# Altium schematic sheet pca10040_sheet1_radio.SchDoc: PCA10040 - nRF Radio
size A4; Revision: 1.1.1; SheetNumber: 1; SheetTotal: 5; DrawnBy: KJP; ProjectNumber: 4397; PCBRevision: 0071KJP; DocumentSize: A4; PCAName: PCA10040; PCBNumber: 400150; ProjectName: Quark
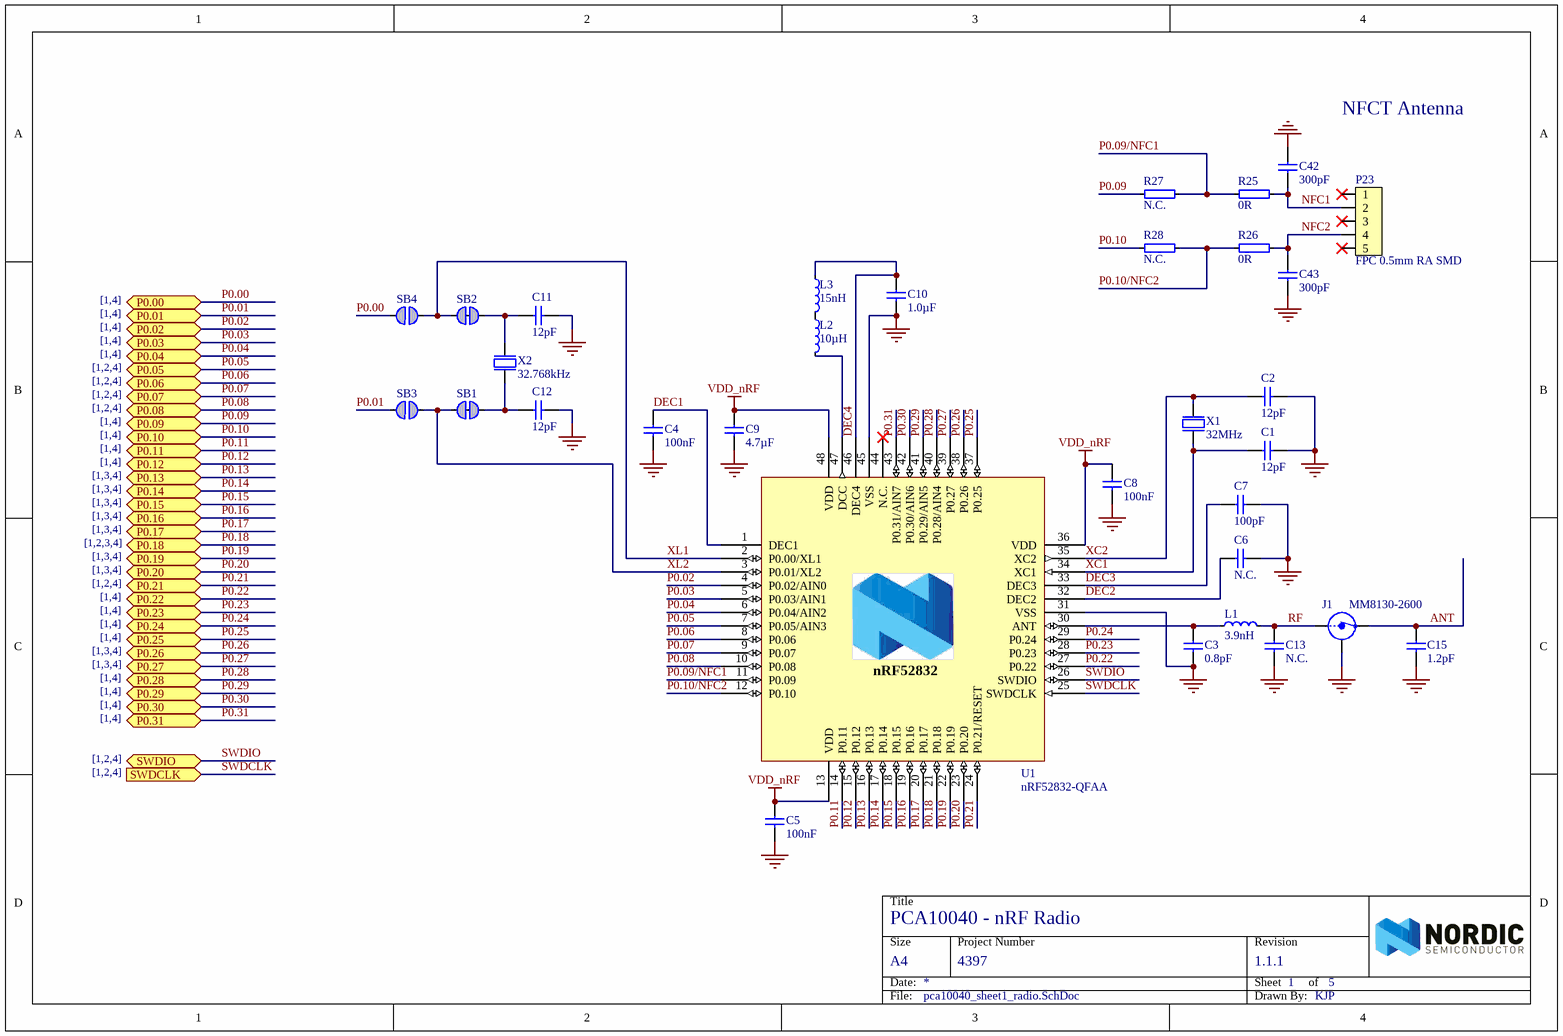
[diagram p0: pca10040_sheet1_radio.SchDoc]

## Parts
C1  12pF  [CAPC1005X04L]
C2  12pF  [CAPC1005X04L]
C3  0.8pF  [CAPC1005X04L]
C4  100nF  [CAPC1005X04L]
C5  100nF  [CAPC1005X04L]
C6  N.C.  [CAPC1005X04L]
C7  100pF  [CAPC1005X04L]
C8  100nF  [CAPC1005X04L]
C9  4.7µF  [CAPC1608X06L]
C10  1.0µF  [CAPC1608X06L]
C11  12pF  [CAPC1005X04L]
C12  12pF  [CAPC1005X04L]
C13  N.C.  [CAPC1005X04L]
C15  1.2pF  [CAPC1005X04L]
C42  300pF  [CAPC1005X04L]
C43  300pF  [CAPC1005X04L]
J1  MM8130-2600  [COAXIAL-SWF]
L1  3.9nH  [INDC1005X04L]
L2  10µH  [INDC1608X06L]
L3  15nH  [INDC1005X04L]
P23  FPC 0.5mm RA SMD  [FPC_05P-0.5mm-RA-SMD]
R25  0R  [RESC1005X04L]
R26  0R  [RESC1005X04L]
R27  N.C.  [RESC1005X04L]
R28  N.C.  [RESC1005X04L]
SB1  Solderbridge  [Solderbridge_Shorted]  (value not drawn)  (net tie, no BOM)
SB2  Solderbridge  [Solderbridge_Shorted]  (value not drawn)  (net tie, no BOM)
SB3  Solderbridge  [Solderbridge]  (value not drawn)  (no BOM)
SB4  Solderbridge  [Solderbridge]  (value not drawn)  (no BOM)
U1  nRF52832-QFAA  [QFN40P600X600X90-48N]
X1  32MHz  [BT-XTAL_2016]
X2  32.768kHz  [XTAL_3215]

## Ports
P0.00 (bidir), P0.01 (bidir), P0.02 (bidir), P0.03 (bidir), P0.04 (bidir), P0.05 (bidir), P0.06 (bidir), P0.07 (bidir), P0.08 (bidir), P0.09 (bidir), P0.10 (bidir), P0.11 (bidir), P0.12 (bidir), P0.13 (bidir), P0.14 (bidir), P0.15 (bidir), P0.16 (bidir), P0.17 (bidir), P0.18 (bidir), P0.19 (bidir), P0.20 (bidir), P0.21 (bidir), P0.22 (bidir), P0.23 (bidir), P0.24 (bidir), P0.25 (bidir), P0.26 (bidir), P0.27 (bidir), P0.28 (bidir), P0.29 (bidir), P0.30 (bidir), P0.31 (bidir), SWDCLK (in), SWDIO (bidir)

## Nets
GND: C1.2 C2.2 C3.1 C4.2 C5.2 C6.2 C7.2 C8.2 C9.2 C10.1 C11.1 C12.1 C13.2 C15.2 C42.2 C43.1 J1.2(Shield) U1.31(VSS) U1.45(VSS) U1.49(GND) X1.2(GND) X1.4(GND)
VDD_nRF: C5.1 C8.1 C9.1 U1.13(VDD) U1.36(VDD) U1.48(VDD)
ANT: C15.1 J1.3(OUT)
DEC1: C4.1 U1.1(DEC1)
DEC2: C6.1 U1.32(DEC2)
DEC3: C7.1 U1.33(DEC3)
DEC4: C10.2 L3.1 U1.46(DEC4)
NFC1: C42.1 P23.2 R25.1
NFC2: C43.2 P23.4 R26.1
P0.00: SB4.2 ; port P0.00
P0.01: SB3.2 ; port P0.01
P0.02: U1.4(P0.02/AIN0) ; port P0.02
P0.03: U1.5(P0.03/AIN1) ; port P0.03
P0.04: U1.6(P0.04/AIN2) ; port P0.04
P0.05: U1.7(P0.05/AIN3) ; port P0.05
P0.06: U1.8(P0.06) ; port P0.06
P0.07: U1.9(P0.07) ; port P0.07
P0.08: U1.10(P0.08) ; port P0.08
P0.09: R27.1 ; port P0.09
P0.09/NFC1: R25.2 R27.2 U1.11(P0.09)
P0.10: R28.1 ; port P0.10
P0.10/NFC2: R26.2 R28.2 U1.12(P0.10)
P0.11: U1.14(P0.11) ; port P0.11
P0.12: U1.15(P0.12) ; port P0.12
P0.13: U1.16(P0.13) ; port P0.13
P0.14: U1.17(P0.14) ; port P0.14
P0.15: U1.18(P0.15) ; port P0.15
P0.16: U1.19(P0.16) ; port P0.16
P0.17: U1.20(P0.17) ; port P0.17
P0.18: U1.21(P0.18) ; port P0.18
P0.19: U1.22(P0.19) ; port P0.19
P0.20: U1.23(P0.20) ; port P0.20
P0.21: U1.24(P0.21/RESET) ; port P0.21
P0.22: U1.27(P0.22) ; port P0.22
P0.23: U1.28(P0.23) ; port P0.23
P0.24: U1.29(P0.24) ; port P0.24
P0.25: U1.37(P0.25) ; port P0.25
P0.26: U1.38(P0.26) ; port P0.26
P0.27: U1.39(P0.27) ; port P0.27
P0.28: U1.40(P0.28/AIN4) ; port P0.28
P0.29: U1.41(P0.29/AIN5) ; port P0.29
P0.30: U1.42(P0.30/AIN6) ; port P0.30
P0.31: U1.43(P0.31/AIN7) ; port P0.31
RF: C13.1 J1.1(IN) L1.2
SWDCLK: U1.25(SWDCLK) ; port SWDCLK
SWDIO: U1.26(SWDIO) ; port SWDIO
XC1: C1.1 U1.34(XC1) X1.1(inp)
XC2: C2.1 U1.35(XC2) X1.3(out)
XL1: SB2.2 SB4.1 U1.2(P0.00/XL1)
XL2: SB1.2 SB3.1 U1.3(P0.01/XL2)
NetC3_2: C3.2 L1.1 U1.30(ANT)
NetC11_2: C11.2 SB2.1 X2.1(inp)
NetC12_2: C12.2 SB1.1 X2.2(out)
NetL2_1: L2.1 L3.2
NetL2_2: L2.2 U1.47(DCC)

Not connected (* = marked no-connect by the designer): P23 1* 3* 5*; U1 44(N.C.)*

## Notes on the sheet
- NFCT Antenna
- [1,4]
- [1,2,4]
- [1,3,4]
- [1,2,3,4]
- Title
- Size
- Date:
- Project Number
- Sheet         of
- Revision
- File:
- Drawn By:
- (in symbol nRF52832-QFAA) nRF52832

## Library data of the parts
C1 C2 C11 C12 = C0402-12p: Capacitor, NP0, ±2%; Note: 50V; Artikkelnr Noca: 20029159; Artikkelnr Simpro: N.A.; Part Number: C0402-12p; Manufacturer: *; Manufacturer Part Number: *; Datasheet: *; LatestRevisionDate: 2011-05-11; Pin Count: 2; Publisher: Nordic Semiconductor; Published: 2009-05-08; Value: 12pF; Supplier: *; Supplier part number: *; 2nd source Supplier: *; 2nd source part number: *; Footprint Doc: 0402
C3 = C0402-0.8p: Capacitor, NP0, ±5%; Note: 50V; Artikkelnr Noca: 20029147; Artikkelnr Simpro: N.A.; Part Number: C0402-0.8p; Manufacturer: *; Manufacturer Part Number: *; Datasheet: *; LatestRevisionDate: 2012-11-21; Pin Count: 2; Publisher: Nordic Semiconductor; Published: 2009-05-08; Value: 0.8pF; Supplier: *; Supplier part number: *; 2nd source Supplier: *; 2nd source part number: *; Footprint Doc: 0402
C4 C5 C8 = C0402-100n: Capacitor, X7R, ±10%; Note: 16V; Artikkelnr Noca: 20039200; Artikkelnr Simpro: N.A.; Part Number: C0402-100n; Manufacturer: *; Manufacturer Part Number: *; Datasheet: *; LatestRevisionDate: 2009-11-23; Pin Count: 2; Publisher: Nordic Semiconductor; Published: 2009-05-08; Value: 100nF; Supplier: *; Supplier part number: *; 2nd source Supplier: *; 2nd source part number: *; Footprint Doc: 0402
C6 C13 = C0402-N.C.: Not mounted; Note: Chip Cap; Artikkelnr Noca: N.A.; Part Number: C0402-N.C.; Manufacturer: *; Manufacturer Part Number: *; Datasheet: *; Footprint Doc: 0402; LatestRevisionDate: 2009-05-08; Pin Count: 2; Publisher: Nordic Semiconductor; Published: 2009-05-08; Value: N.C.; Supplier: *; Supplier part number: *; 2nd source Supplier: *; 2nd source part number: *; Artikkelnr Simpro: N.A.
C7 = C0402-100p: Capacitor, NP0, ±5%; Note: 50V; Artikkelnr Noca: 20029135; Artikkelnr Simpro: N.A.; Part Number: C0402-100p; Manufacturer: *; Manufacturer Part Number: *; Datasheet: *; LatestRevisionDate: 2009-05-08; Pin Count: 2; Publisher: Nordic Semiconductor; Published: 2009-05-08; Value: 100pF; Supplier: *; Supplier part number: *; 2nd source Supplier: *; 2nd source part number: *; Footprint Doc: 0402
C9 = C0603-4µ7: Capacitor, X5R, ±10%; Note: 6.3V; Artikkelnr Noca: 20069060; Artikkelnr Simpro: N.A.; Part Number: C0603-4µ7; Manufacturer: *; Manufacturer Part Number: *; Datasheet: *; LatestRevisionDate: 2009-11-23; Pin Count: 2; Publisher: Nordic Semiconductor; Published: 2009-05-08; Value: 4.7µF; Supplier: *; Supplier part number: *; 2nd source Supplier: *; 2nd source part number: *; Footprint Doc: 0603
C10 = C0603-1µ0: Capacitor, X7R, ±10%; Note: 16V; Artikkelnr Noca: 20039335; Artikkelnr Simpro: N.A.; Part Number: C0603-1µ0; Manufacturer: *; Manufacturer Part Number: *; Datasheet: *; LatestRevisionDate: 2013-06-05; Pin Count: 2; Publisher: Nordic Semiconductor; Published: 2009-05-08; Value: 1.0µF; Supplier: *; Supplier part number: *; 2nd source Supplier: *; 2nd source part number: *; Footprint Doc: 0603
C15 = C0402-1.2p: Capacitor, NP0, ±0.1pF; Note: 50V; Artikkelnr Noca: 20029157; Artikkelnr Simpro: N.A.; Part Number: C0402-1.2p; Manufacturer: *; Manufacturer Part Number: *; Datasheet: *; LatestRevisionDate: 2011-05-11; Pin Count: 2; Publisher: Nordic Semiconductor; Published: 2009-05-08; Value: 1.2pF; Supplier: *; Supplier part number: *; 2nd source Supplier: *; 2nd source part number: *; Footprint Doc: 0402
C42 C43 = C0402-300p: Capacitor, NP0, ±5%; Note: 50V; Artikkelnr Noca: N.A.; Part Number: C0402-300p; Manufacturer: *; Manufacturer Part Number: *; Datasheet: *; Footprint Doc: 0402; LatestRevisionDate: 2015-05-29; Pin Count: 2; Publisher: Nordic Semiconductor; Published: 2015-05-29; Value: 300pF; Supplier: Digi-Key; Supplier part number: 490-3234-1-ND; 2nd source Supplier: *; 2nd source part number: *; Artikkelnr Simpro: N.A.
J1 = MM8130-2600: Coaxial Connector with Switch; Manufacturer: Murata; 2nd source part number: 81-MM8130-2600RA2; Artikkelnr Noca: 55029011; Artikkelnr Simpro: N.A.; Part Number: MM8130-2600; Manufacturer Part Number: MM8130-2600; Datasheet: http://www.murata.com/products/catalog/pdf/o33e.pdf; LatestRevisionDate: 2014-04-24; Pin Count: 3; Publisher: Nordic Semiconductor; Published: 2014-04-24; Value: MM8130-2600; Note: *; Supplier: Digi-Key; Supplier part number: 490-4981-1-ND; 2nd source Supplier: Mouser; Footprint Doc: COAXIAL-SWF
L1 = L0402-3n9: Inductor, 170mA, ±0.1nH; Manufacturer: Murata; Manufacturer Part Number: LQP15MN3N9B02D; Note: High frequency chip inductor ±5%; Artikkelnr Noca: 33029151; Artikkelnr Simpro: N.A.; Part Number: L0402-3n9; Datasheet: http://search.murata.co.jp/Ceramy/image/img/PDF/ENG/L0075S0084LQP15M.pdf; LatestRevisionDate: 2012-09-19; Pin Count: 2; Publisher: Nordic Semiconductor; Published: 2009-05-08; Value: 3.9nH; Supplier: Digi-Key; Supplier part number: 490-1131-1-ND; 2nd source Supplier: *; 2nd source part number: *; Footprint Doc: 0402
L2 = L0603-10µ: Inductor, 80mA, ±10%; Manufacturer: Taiyo Yuden; Manufacturer Part Number: LBMF1608T100K; 2nd source part number: 178-6105; Note: LBMF1608T100K 10µH 80mA 0603; Artikkelnr Noca: 33029314; Artikkelnr Simpro: N.A.; Part Number: L0603-10µ; Datasheet: http://www.yuden.co.jp/ut/product/pdf/elb2_e.pdf; LatestRevisionDate: 2012-09-19; Pin Count: 2; Publisher: Nordic Semiconductor; Published: 2010-02-24; Value: 10µH; Supplier: Digi-Key; Supplier part number: 587-1714-1-ND; 2nd source Supplier: Farnell; Footprint Doc: 0603
L3 = L0402-15n: Inductor, 320mA, ±5%; Manufacturer: Taiyo Yuden; Manufacturer Part Number: HK100515NJ-T; 2nd source part number: 658-1328; Note: High frequency chip inductor ±10%; Artikkelnr Noca: 33029323; Artikkelnr Simpro: N.A.; Part Number: L0402-15n; LatestRevisionDate: 2012-09-19; Pin Count: 2; Publisher: Nordic Semiconductor; Published: 2010-07-12; Value: 15nH; Supplier: Digi-Key; Datasheet: http://www.yuden.co.jp/productdata/catalog/en/mlci04_e.pdf; Supplier part number: 587-1521-1-ND; 2nd source Supplier: Farnell; Footprint Doc: 0402
P23 = FPC_05P-0.5mm-RA-SMD: 0.5mm FPC, 5P,Right Angle SMT,Double Contact,H=1.2mm,White, Tin plated; Manufacturer: W-CON; Manufacturer Part Number: 5141-05RZDNWR01; 2nd source part number: WM9836CT-ND; Artikkelnr Noca: 55010020; Artikkelnr Simpro: N.A.; Part Number: FPC_05P-0.5mm-RA-SMD; Datasheet: \\hizz\pro\app9717\Datasheet\connectores\W-CON\5141-XXRZDNXX0X.pdf; Footprint Doc: FPC_05P-0.5mm-RA-SMD; LatestRevisionDate: 2016-04-21; Pin Count: 7; Publisher: Nordic Semiconductor; Published: 2015-06-22; Value: FPC 0.5mm RA SMD; Note: *; Supplier: Cabcon; Supplier part number: 5141-05RZDNWR01; 2nd source Supplier: Digi-Key
R25 R26 = R0402-0R: Resistor, ±5%, 0.063W; Note: Chip Res 5%; Artikkelnr Noca: 27049000; Artikkelnr Simpro: N.A.; Part Number: R0402-0R; Manufacturer: *; Manufacturer Part Number: *; Datasheet: *; Footprint Doc: 0402; LatestRevisionDate: 2009-11-23; Pin Count: 2; Publisher: Nordic Semiconductor; Published: 2009-05-08; Value: 0R; Supplier: Farnell; Supplier part number: 146-9661; 2nd source Supplier: *; 2nd source part number: *
R27 R28 = R0402-N.C.: Not mounted; Note: Chip Res; Artikkelnr Noca: N.A.; Part Number: R0402-N.C.; Manufacturer: *; Manufacturer Part Number: *; Datasheet: *; Footprint Doc: 0402; LatestRevisionDate: 2009-05-08; Pin Count: 2; Publisher: Nordic Semiconductor; Published: 2009-05-08; Value: N.C.; Supplier: *; Supplier part number: *; 2nd source Supplier: *; 2nd source part number: *; Artikkelnr Simpro: N.A.
SB1 SB2 = Solderbridge Shorted: Shorted Solderbridge; Artikkelnr Noca: N.A.; Part Number: Solderbridge Shorted; Manufacturer: *; Manufacturer Part Number: *; Datasheet: *; LatestRevisionDate: 2012-08-07; Pin Count: 2; Publisher: Nordic Semiconductor; Published: 2012-08-07; Value: Solderbridge; Note: *; Supplier: *; Supplier part number: *; 2nd source Supplier: *; 2nd source part number: *; Footprint Doc: Solderbridge_Shorted; Artikkelnr Simpro: N.A.
SB3 SB4 = Solderbridge: Artikkelnr Noca: N.A.; Part Number: Solderbridge; Manufacturer: *; Manufacturer Part Number: *; Datasheet: *; LatestRevisionDate: 2009-12-14; Pin Count: 2; Publisher: Nordic Semiconductor; Published: 2009-12-14; Value: Solderbridge; Note: *; Supplier: *; Supplier part number: *; 2nd source Supplier: *; 2nd source part number: *; Footprint Doc: Solderbridge; Artikkelnr Simpro: N.A.
U1 = nRF52832-QFAA: Multi-protocol Bluetooth Low Energy and 2.4GHz proprietary system-on-chip; Manufacturer: Nordic Semiconductor; Artikkelnr Noca: N.A.; Part Number: nRF52832-QFAA; Manufacturer Part Number: nRF52832-QFAA; Datasheet: *; LatestRevisionDate: 2014-11-26; Pin Count: 48; Publisher: Nordic Semiconductor; Published: 2014-11-26; Value: nRF52832-QFAA; Note: *; Supplier: Nordic Semiconductor; Supplier part number: *; 2nd source Supplier: *; 2nd source part number: *; Footprint Doc: QFN-48; Artikkelnr Simpro: N.A.
X1 = XTAL_SMD2016_32MHz_8pF_Epson: XTAL SMD 2016, 32MHz, Cl=8pF, Tol: ±10ppm, Stab: ±10ppm; Manufacturer: Epson Toyocom; Manufacturer Part Number: Q22FA12800025; Note: XTAL SMD 32.000MHz; Artikkelnr Noca: N.A.; Part Number: XTAL_SMD2016_32MHz_8pF_Epson; Datasheet: http://www.epsondevice.com/docs/qd/en/DownloadServlet?id=ID000449; LatestRevisionDate: 2014-11-27; Pin Count: 4; Publisher: Nordic Semiconductor; Published: 2012-03-09; Value: 32MHz; Supplier: Farnell; Supplier part number: 171-2806; 2nd source Supplier: *; 2nd source part number: *; Footprint Doc: XTAL_2016; Artikkelnr Simpro: N.A.
X2 = XTAL_FC-135 32.768k: EPSON TOYOCOM - FC-135 32.768KHZ ±20PPM,9.0PF - CRYSTAL, SM, WATCH; 2nd source part number: 127-8037; Note: XTAL SMD 32.768kHz, 3215; Artikkelnr Noca: 22019091; Artikkelnr Simpro: N.A.; Part Number: XTAL_FC-135 32.768k; Manufacturer: Epson Toyocom; Manufacturer Part Number: FC-135 32.768KHZ ±20PPM,9.0PF; Datasheet: http://www.farnell.com/datasheets/57480.pdf; LatestRevisionDate: 2014-03-27; Pin Count: 2; Publisher: Nordic Semiconductor; Published: 2010-10-18; Value: 32.768kHz; Supplier: Digi-Key; Supplier part number: FC-135 32.7680KA-AC-ND; 2nd source Supplier: Farnell; Footprint Doc: XTAL_3215